# Altium project LMR14050.PrjPcb
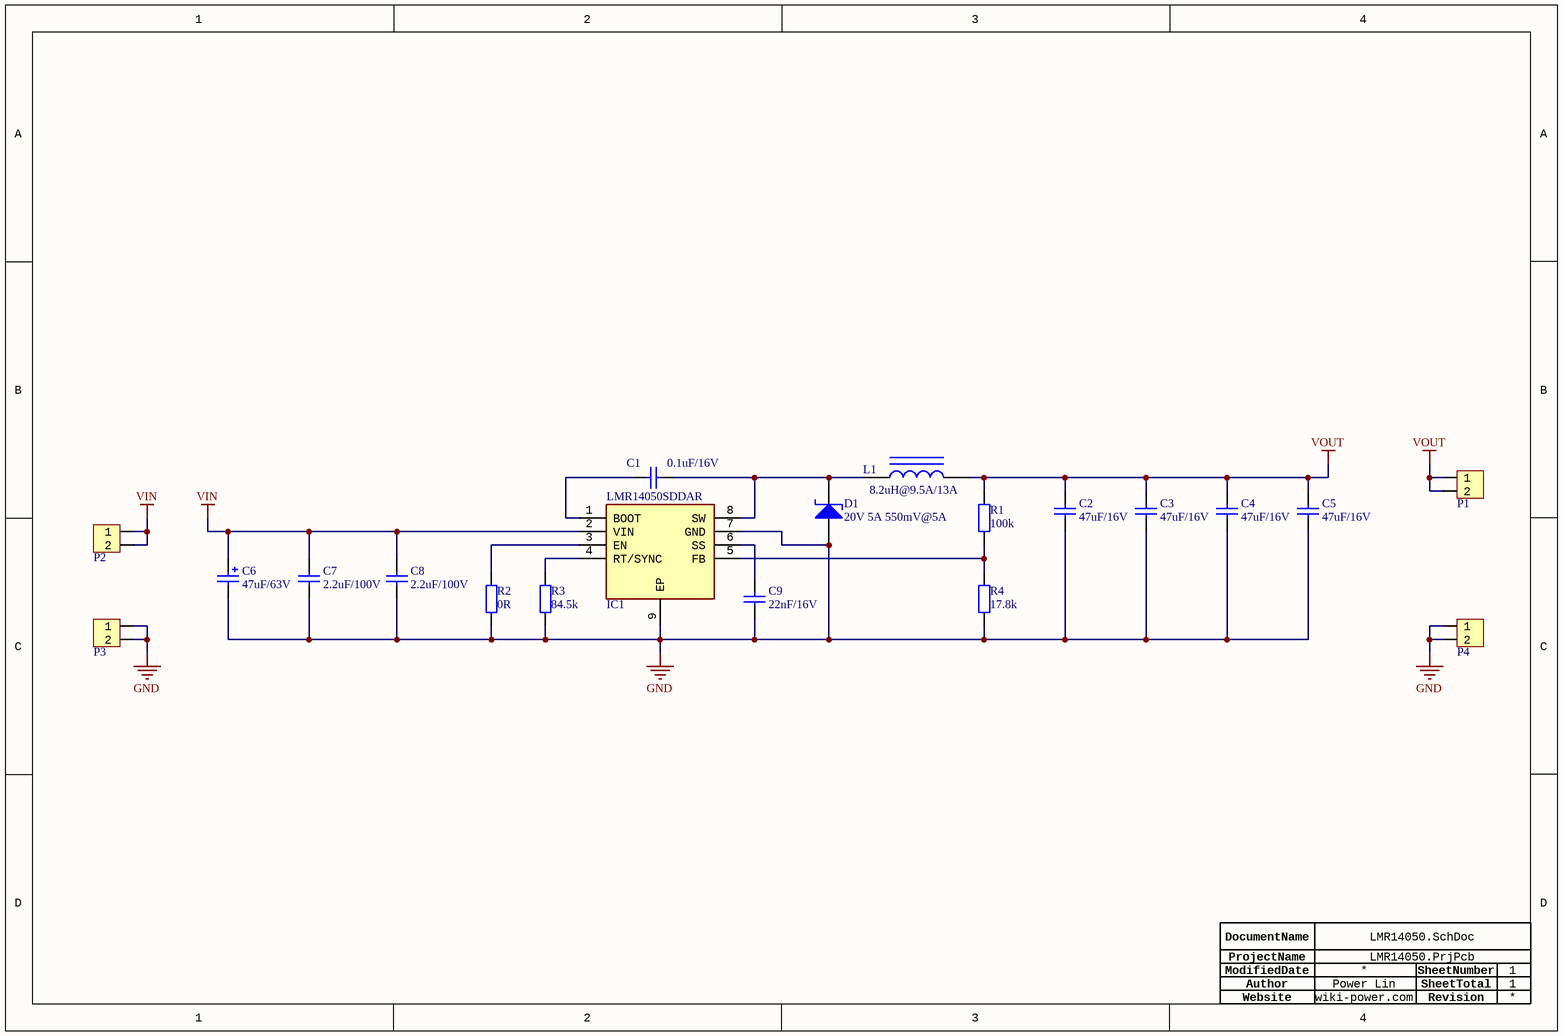
[diagram p0: LMR14050.SchDoc]
1 sheet, 20 parts. Net scope: global (net labels, ports and power ports of the same name join across sheets).
Board file: LMR14050.PcbDoc

## Sheet LMR14050.SchDoc
size A4; Author: Power Lin; SheetNumber: 1; SheetTotal: 1; Website: wiki-power.com

### Parts
C1  0.1uF/16V  [CAP-0603]
C2  47uF/16V  [CAP-1210]
C3  47uF/16V  [CAP-1210]
C4  47uF/16V  [CAP-1210]
C5  47uF/16V  [CAP-1210]
C6  47uF/63V  [C_SMD-8X10]
C7  2.2uF/100V  [CAP-1206]
C8  2.2uF/100V  [CAP-1206]
C9  22nF/16V  [CAP-0603]
D1  20V 5A 550mV@5A  [DO-214AB/SMC]
IC1  LMR14050SDDAR  [HSOIC-8]
L1  8.2uH@9.5A/13A  [SMD-13.45x12.6x4.8mm]
P1  HDR1x2_2.54  [HDR1X2_2.54_180]  (value not drawn)
P2  HDR1x2_2.54  [HDR1X2_2.54_180]  (value not drawn)
P3  HDR1x2_2.54  [HDR1X2_2.54_180]  (value not drawn)
P4  HDR1x2_2.54  [HDR1X2_2.54_180]  (value not drawn)
R1  100k  [R-0603]
R2  0R  [R-0603]
R3  84.5k  [R-0603]
R4  17.8k  [R-0603]

### Nets
GND: C2.1 C3.1 C4.1 C5.1 C6.2 C7.1 C8.1 C9.1 D1.1(A) IC1.7(GND) IC1.9(EP) P3.1 P3.2 P4.1 P4.2 R2.1 R3.1 R4.1
VIN: C6.1 C7.2 C8.2 IC1.2(VIN) P2.1 P2.2
VOUT: C2.2 C3.2 C4.2 C5.2 L1.2 P1.1 P1.2 R1.2
NetC1_1: C1.1 IC1.1(BOOT)
NetC1_2: C1.2 D1.2(K) IC1.8(SW) L1.1
NetC9_2: C9.2 IC1.6(SS)
NetIC1_3: IC1.3(EN) R2.2
NetIC1_4: IC1.4(RT/SYNC) R3.2
NetIC1_5: IC1.5(FB) R1.1 R4.2

### Notes on the sheet
- Author
- DocumentName
- ModifiedDate
- ProjectName
- SheetNumber
- SheetTotal
- Website
- Revision

### Library data of the parts
C1 = CAP: CC0603KRX7R7BB104; ComponentLink1Description: 供应商链接; ComponentLink1URL: http://www.szlcsc.com/product/details_53938.html; Package: 0402; Supplier: LC; SuppliersPartNumber: C52923
C2-C5 = CAP: C1210X5R476K160NT; ComponentLink1Description: 供应商链接; ComponentLink1URL: http://www.szlcsc.com/product/details_53938.html; Package: 0402; Supplier: LC; SuppliersPartNumber: C52923
C6 = CAP-POL: RVT1J470M0810; ComponentLink1Description: 供应商链接; ComponentLink1URL: http://www.szlcsc.com/product/details_16815.html; Package: 3528; Supplier: LC; SuppliersPartNumber: C16133
C7 C8 = CAP: CS3216X7R225K101NRI; ComponentLink1Description: 供应商链接; ComponentLink1URL: http://www.szlcsc.com/product/details_53938.html; Package: 0402; Supplier: LC; SuppliersPartNumber: C52923
C9 = CAP: CC0603KRX7R7BB223; ComponentLink1Description: 供应商链接; ComponentLink1URL: http://www.szlcsc.com/product/details_53938.html; Package: 0402; Supplier: LC; SuppliersPartNumber: C52923
D1 = DIODE_Schottky: SS52
IC1 = LMR14050SDDAR: Manufacturer_Name: Texas Instruments; Datasheet Link: http://www.ti.com/lit/gpn/lmr14050; Height: 1.7mm; Manufacturer_Part_Number: LMR14050SDDAR; Mouser Part Number: 595-LMR14050SDDAR; Mouser Price/Stock: https://www.mouser.co.uk/ProductDetail/Texas-Instruments/LMR14050SDDAR?qs=G5PZsBocSXuzvyUQdQ5q2Q%3D%3D; Arrow Part Number: LMR14050SDDAR; Arrow Price/Stock: https://www.arrow.com/en/products/lmr14050sddar/texas-instruments?region=nac
L1 = INDUCTOR: MDE1250-8R2M; ComponentLink1Description: 供应商链接; ComponentLink1URL: http://www.szlcsc.com/product/details_33003.html; Package: 0402; Supplier: LC; SuppliersPartNumber: C32041
P1-P4 = HDR1x2_2.54: Header
R1 = RES: RC0603FR-07100KL; Package: 0805; Supplier: LC; SuppliersPartNumber: C17798
R2 = RES: DNP; Package: 0805; Supplier: LC; SuppliersPartNumber: C17798
R3 = RES: RC0603FR-0784K5L; Package: 0805; Supplier: LC; SuppliersPartNumber: C17798
R4 = RES: RC0603FR-0717K8L; Package: 0805; Supplier: LC; SuppliersPartNumber: C17798